# Altium schematic sheet TlcMini.SchDoc
size A4
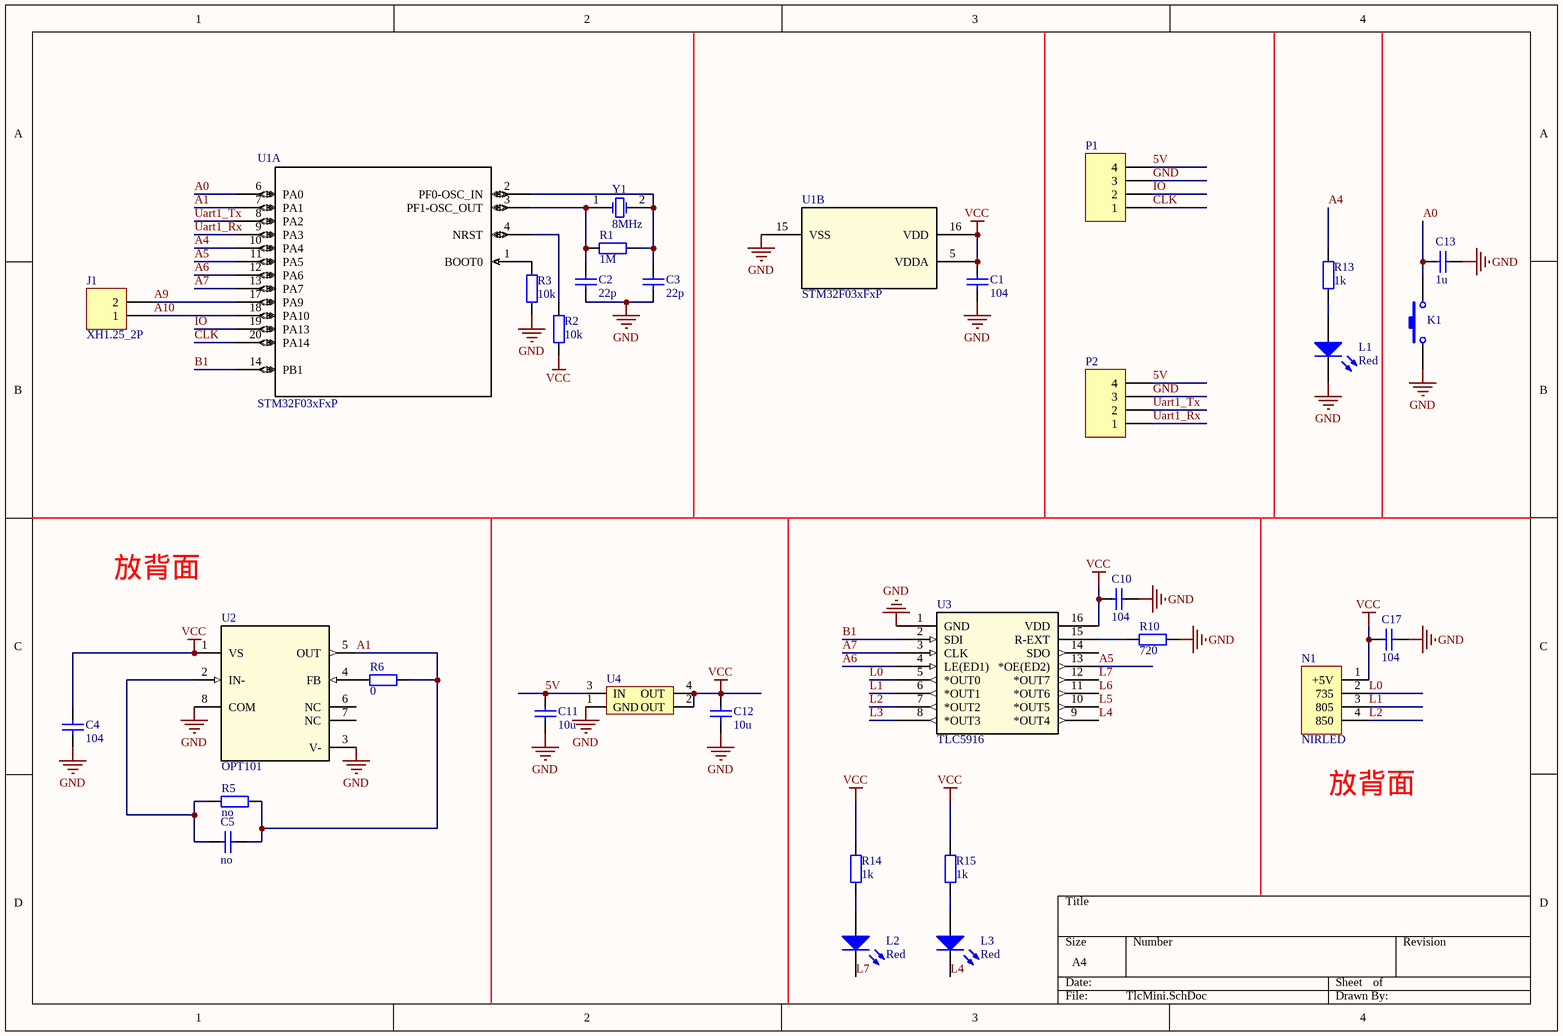
[diagram p0: TlcMini.SchDoc]

## Parts
C1  104  [0805]
C2  22p  [0805]
C3  22p  [0805]
C4  104  [0805]
C5  no  [0805]
C10  104  [0805]
C11  10u  [0805]
C12  10u  [0805]
C13  1u  [0805]
C17  104  [0805]
J1  XH1.25_2P  [XH1.25_2P]
K1  SW  [SWITCH]  (value not drawn)
L1  Red  [0805]
L2  Red  [0805]
L3  Red  [0805]
N1  NIRLED  [OTP]
P1  Header 4  [HDR1X4]  (value not drawn)
P2  Header 4  [HDR1X4]  (value not drawn)
R1  1M  [0805]
R2  10k  [0805]
R3  10k  [0805]
R5  no  [0805]
R6  0  [0805]
R10  720  [0805]
R13  1k  [0805]
R14  1k  [0805]
R15  1k  [0805]
U1  STM32F03xFxP  [TSSOP20]  (parts A,B of 2)
U2  OPT101  [NTC8]
U3  TLC5916  [D16]
U4  AMS1117-3.3  [AMS1117]  (value not drawn)
Y1  8MHz  [3215-2]

## Nets
GND: C1.1 C2.1 C3.1 C4.1 C10.2 C11.2 C12.2 C13.2 C17.2 K1.1 L1.2(K) P1.3 P2.3 R3.1 R10.2 U1.15(VSS) U2.3(V-) U2.8(COM) U3.1(GND) U4.1(GND)
VCC: C1.2 C4.2 C10.1 C12.1 C17.1 N1.1(+5V) R2.1 R14.2 R15.2 U1.5(VDDA) U1.16(VDD) U2.1(VS) U3.16(VDD) U4.2(OUT) U4.4(OUT)
5V: C11.1 P1.4 P2.4 U4.3(IN)
A0: C13.1 K1.2 U1.6(PA0)
A1: C5.2 R5.2 R6.2 U1.7(PA1) U2.5(OUT)
A4: R13.2 U1.10(PA4)
A5: U1.11(PA5) U3.13(*OE(ED2))
A6: U1.12(PA6) U3.4(LE(ED1))
A7: U1.13(PA7) U3.3(CLK)
A9: J1.2 U1.17(PA9)
A10: J1.1 U1.18(PA10)
B1: U1.14(PB1) U3.2(SDI)
CLK: P1.1 U1.20(PA14)
IO: P1.2 U1.19(PA13)
L0: N1.2(735) U3.5(*OUT0)
L1: N1.3(805) U3.6(*OUT1)
L2: N1.4(850) U3.7(*OUT2)
L3: U3.8(*OUT3)
L4: L3.2(K) U3.9(*OUT4)
L5: U3.10(*OUT5)
L6: U3.11(*OUT6)
L7: L2.2(K) U3.12(*OUT7)
Uart1_Rx: P2.1 U1.9(PA3)
Uart1_Tx: P2.2 U1.8(PA2)
NetC2_2: C2.2 R1.1 U1.3(PF1-OSC_OUT) Y1.1(OSC1)
NetC3_2: C3.2 R1.2 U1.2(PF0-OSC_IN) Y1.2(OSC2)
NetC5_1: C5.1 R5.1 U2.2(IN-)
NetL1_1: L1.1(A) R13.1
NetL2_1: L2.1(A) R14.1
NetL3_1: L3.1(A) R15.1
NetR2_2: R2.2 U1.4(NRST)
NetR3_2: R3.2 U1.1(BOOT0)
NetR6_1: R6.1 U2.4(FB)
NetR10_1: R10.1 U3.15(R-EXT)

Not connected (* = marked no-connect by the designer): U2 6(NC) 7(NC); U3 14(SDO)

## Notes on the sheet
- 放背面
- (near N1) 放背面

## Library data of the parts
C1-C5 C10-C13 C17 = C: Capacitor; Published: 8-Jun-2000; LatestRevisionDate: 17-Jul-2002; LatestRevisionNote: Re-released for DXP Platform.; PackageReference: RAD-0.3; Publisher: Altium Limited; PackageDescription: Radial Cap, Thru-Hole; 2 Leads; 0.3 in Pin Spacing
J1 = XH1.25_2P: Header, 10-Pin
K1 = SW: Switch
L1-L3 = LED: Published: 8-Jun-2000; LatestRevisionDate: 08-Jul-2005; LatestRevisionNote: Mech Layer 1 removed.; PackageReference: LED-0; Publisher: Altium Limited; PackageDescription: LED; 2 Leads
P1 P2 = Header 4: Header, 4-Pin; LatestRevisionDate: 17-Jul-2002; LatestRevisionNote: Re-released for DXP Platform.; Publisher: Altium Limited
R1-R3 R5 R6 R10 R13-R15 = R: Resistor; Published: 8-Jun-2000; LatestRevisionDate: 17-Jul-2002; LatestRevisionNote: Re-released for DXP Platform.; PackageReference: AXIAL-0.4; Publisher: Altium Limited; PackageDescription: Axial Device, Thru-Hole; 2 Leads; 0.4 in Pin Spacing
U1 = STM32F03xFxP: Mcu; Vendor: STMicroelectronics; C: Copyright (C) 2016 Accelerated Designs. All rights reserved; Copyright: Copyright (C) 2016 Accelerated Designs. All rights reserved; Manufacturer_Part_Number: stm32f03xfxp; RefDes: RefDes; Type: Type; Value: Value
U2 = OPT101: Sence; PartNumber: OPT101P-J; Manufacturer: Texas Instruments; CompType: IC; PIN_COUNT: 8; Application_BuildNumber: *; PackageReference: DTL0008A; MountType: SMT; RoHS: Y; RefDes: RefDes; TYPE: TYPE; Value: Value
U3 = TLC5916: Driver; Manufacturer_Part_Number: tlc5916-q1_d_16; GENERIC_PART_NUMBER: TLC5916-Q1; Vendor: Texas Instruments; PACKAGE_DESIGNATOR: D; PIN_COUNT: 16; FAMILY_NAME: LED DRIVER; INDUSTRY_STD_PKG_TYPE: SOIC; Manufacturer: Texas Instruments; Datasheet_URL: http://www.ti.com/lit/gpn/TLC5916-Q1; Value: Value; Type: Type; RefDes: RefDes
U4 = AMS1117
Y1 = XTAL: Crystal Oscillator; Published: 8-Jun-2000; LatestRevisionDate: 17-Jul-2002; LatestRevisionNote: Re-released for DXP Platform.; Publisher: Altium Limited